# Altium schematic sheet jelly_fish.SchDoc
size A
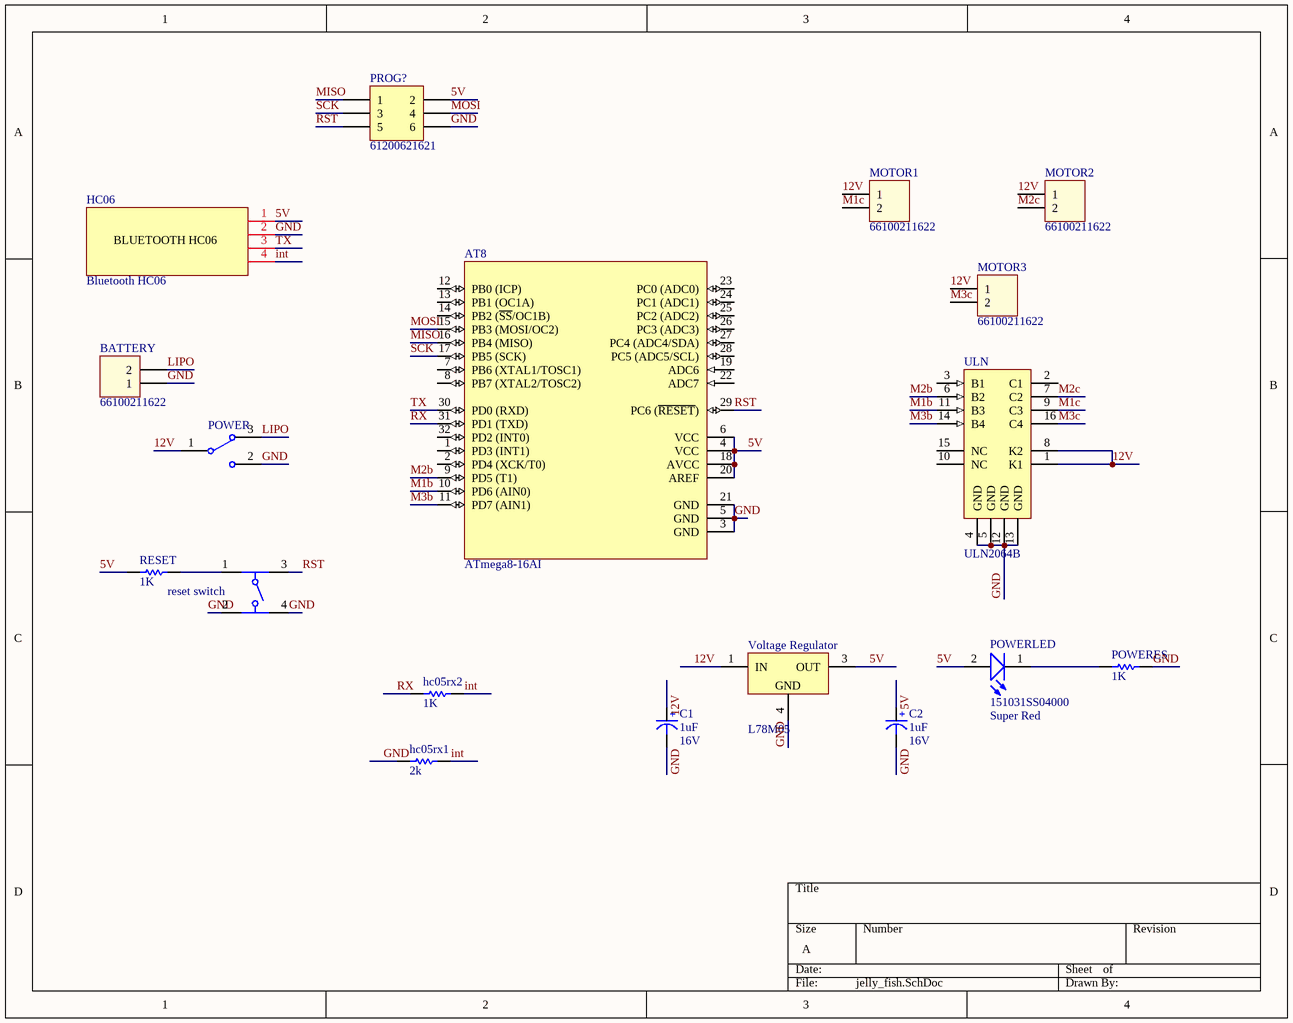
[diagram p0: jelly_fish.SchDoc]

## Parts
AT8  ATmega8-16AI  [32A_L]
BATTERY  66100211622  [66100211622]
C1  Voltage: 16V  [cap 01]  (hidden comment: 1uF)
C2  Voltage: 16V  [cap 01]  (hidden comment: 1uF)
hc05rx1  2k  [RESC3413X04N]
hc05rx2  1K  [RESC3413X04N]
HC06  Bluetooth HC06  [BLUETOOTH HC06_2]
MOTOR1  66100211622  [66100211622]
MOTOR2  66100211622  [66100211622]
MOTOR3  66100211622  [66100211622]
POWER  450301014042  [450301014042]  (value not drawn)
POWERES  1K  [RESC3413X04N]
POWERLED  151031SS04000  Emitting Color: Super Red  [WL-TMRC_3 mm]
PROG?  61200621621  [61200621621]
RESET  1K  [RESC3413X04N]
reset_switch  (no value)  [4301x60707x6_6x6x7]
ULN  ULN2064B  [DIP16]
Voltage_Regulator  L78M05  [TO-252]

## Nets
5V: AT8.4(VCC) AT8.6(VCC) AT8.18(AVCC) AT8.20(AREF) C2.1(+) HC06.1 POWERLED.2(A) PROG?.2 RESET.1 Voltage_Regulator.3(OUT)
12V: C1.1(+) MOTOR1.1 MOTOR2.1 MOTOR3.1 POWER.1(COM) ULN.1(K1) ULN.8(K2) Voltage_Regulator.1(IN)
GND: AT8.3(GND) AT8.5(GND) AT8.21(GND) BATTERY.1 C1.2(-) C2.2(-) hc05rx1.1 HC06.2 POWER.2 POWERES.2 PROG?.6 reset_switch.2 reset_switch.4 ULN.4(GND) ULN.5(GND) ULN.12(GND) ULN.13(GND) Voltage_Regulator.4(GND)
int: hc05rx1.2 hc05rx2.2 HC06.4
LIPO: BATTERY.2 POWER.3
M1b: AT8.10(PD6_(AIN0)) ULN.11(B3)
M1c: MOTOR1.2 ULN.9(C3)
M2b: AT8.9(PD5_(T1)) ULN.6(B2)
M2c: MOTOR2.2 ULN.7(C2)
M3b: AT8.11(PD7_(AIN1)) ULN.14(B4)
M3c: MOTOR3.2 ULN.16(C4)
MISO: AT8.16(PB4_(MISO)) PROG?.1
MOSI: AT8.15(PB3_(MOSI/OC2)) PROG?.4
RST: AT8.29(PC6_(~{RESET})) PROG?.5 reset_switch.3
RX: AT8.31(PD1_(TXD)) hc05rx2.1
SCK: AT8.17(PB5_(SCK)) PROG?.3
TX: AT8.30(PD0_(RXD)) HC06.3
NetPOWERES_1: POWERES.1 POWERLED.1(K)
NetRESET_2: RESET.2 reset_switch.1

Not connected (* = marked no-connect by the designer): AT8 1(PD3_(INT1)) 2(PD4_(XCK/T0)) 7(PB6_(XTAL1/TOSC1)) 8(PB7_(XTAL2/TOSC2)) 12(PB0_(ICP)) 13(PB1_(OC1A)) 14(PB2_(~{SS}/OC1B)) 19(ADC6) 22(ADC7) 23(PC0_(ADC0)) 24(PC1_(ADC1)) 25(PC2_(ADC2)) 26(PC3_(ADC3)) 27(PC4_(ADC4/SDA)) 28(PC5_(ADC5/SCL)) 32(PD2_(INT0)); ULN 2(C1) 3(B1) 10(NC) 15(NC)

## Notes on the sheet
- (in symbol Bluetooth HC06) BLUETOOTH HC06

## Library data of the parts
AT8 = ATmega8-16AI: 8-Bit AVR Microcontroller with 8K Bytes of In-System Programmable Flash Memory; Published: 17-Sep-2003; LatestRevisionDate: 16-Oct-2006; LatestRevisionNote: IPC-7351 Footprint Added.; DatasheetVersion: 2486H-AVR-09/02; PackageVersion: revB, Oct-2001; PackageReference: 32A; Publisher: Altium Limited; PackageDescription: 32-Lead, 7x7x1.0 mm Body, 0.8mm Lead Pitch, Thin Profile Plastic Quad Flat Package (TQFP); Supplier 1: Digi-Key; Supplier Part Number 1: ATMEGA8-16AI-ND; Supplier 2: Mouser; Supplier Part Number 2: 556-ATMEGA8-16AI; Code_JEDEC: MS-026-ABA; ComponentLink1Description: Datasheet; ComponentLink1URL: http://www.atmel.com/dyn/resources/prod_documents/doc2486.pdf; ComponentLink2Description: Atmel.com Home; ComponentLink2URL: http://www.atmel.com
BATTERY MOTOR1-MOTOR3 = 66100211622: WR-WTB 2.54 mm Intercom Male Horizontal Shrouded Header, 2p; Pitch: 2.54 mm; Pin Number: 2; ComponentLink1Description: Manufacturer; ComponentLink1URL: http://www.we-online.de; ComponentLink2Description: Datasheet; ComponentLink2URL: http://katalog.we-online.de/em/datasheet/6610XX11622.pdf; Part Number: 66100211622; Published Date: June 2017; Publisher: Wurth Elektronik
C1 C2 = CAP_Polar: Polar Capacitor; Designer: Eng. Saeid Jorablo; Company: SJ Libraries; ComponentLink1Description: Datasheet; ComponentLink2Description: Reference; Publisher: SJ Unlimited; Mounting Technology: Surface Mount\Through-Hole; HelpURL: http://s3.picofile.com/file/7443264187/Coming_Soon_logo.gif; Status: Unreleased; Value: 1uF
hc05rx1 hc05rx2 POWERES RESET = RES 0805 0.125W: RES 0805; Designer: Abbas Basereh; Desc.: RES SMD 0805; Data: 16-12-2016
HC06 = Bluetooth HC06: Telegram channel :: @AltiumDesignerLearning
POWER = 450301014042: WS-SLTV 10x2.5 mm THT; ComponentLink1Description: Manufacturer; ComponentLink1URL: http://www.we-online.de; ComponentLink2Description: Datasheet; ComponentLink2URL: http://katalog.we-online.de/em/datasheet/450301014042.pdf; Part Number: 450301014042; Published Date: June 2017; Publisher: Wurth Elektronik
POWERLED = 151031SS04000: WL-TMRC THT Mono-color Round Color, 3 mm, Super Red; Forward Voltage: 2 V; Viewing Angle: 40°; Luminous Intensity: 160 mcd; Published Date: Jan 2017; Publisher: Wurth Elektronik; ComponentLink1Description: Manufacturer; ComponentLink1URL: http://www.we-online.de; ComponentLink2Description: Datasheet; ComponentLink2URL: http://katalog.we-online.de/led/datasheet/151031SS04000.pdf; Part Number: 151031SS04000; Size: 3 mm
PROG? = 61200621621: WR-BHD 2.54mm Male Box Header; Manufacturer: Wurth Elektronik; ComponentLink1 Description: Manufacturer; ComponentLink2 Description: Datasheet; NoPins: 6; Created Date: March 2016; partNo: 61200621621; ComponentLink1URL: http://www.we-online.com; ComponentLink2URL: http://katalog.we-online.de/em/datasheet/6120xx21621.pdf; Created by: Baojun Chen
reset_switch = 430156070736: WS-TATV 6x6mm Tact Switch, THT version; Operation Force: 360g; ComponentLink1Description: Manufacturer; ComponentLink1URL: http://www.we-online.de; ComponentLink2Description: Datasheet; ComponentLink2URL: http://katalog.we-online.de/em/datasheet/4301x6xxx7x6.pdf; Part Number: 430156070736; Published Date: June 2017; Publisher: Wurth Elektronik; Size: 6x6x7 mm; Life Cycle: 200000 cycles
ULN = ULN2064B: 50 V -1.5 A Quad Darlington Switch; Published: 8-Jun-2000; LatestRevisionDate: 06-Jun-2005; LatestRevisionNote: Stylized 3D Model Added.; DatasheetVersion: Apr-1993; PackageVersion: Apr-1996; PackageReference: DIP16; Publisher: Altium Limited; PackageDescription: DIP; 16 Leads; Row Spacing 7.62 mm; Pitch 2.54 mm; ComponentLink1Description: Manufacturer Link; ComponentLink1URL: http://www.st.com/; ComponentLink2Description: Datasheet; ComponentLink2URL: http://www.st.com/stonline/products/literature/ds/1534/uln2064b.pdf
Voltage_Regulator = L78M05: Precision 500mA Regulator